# Altium schematic sheet 3DMouseMainBoardAssembly.SchDoc
size Letter
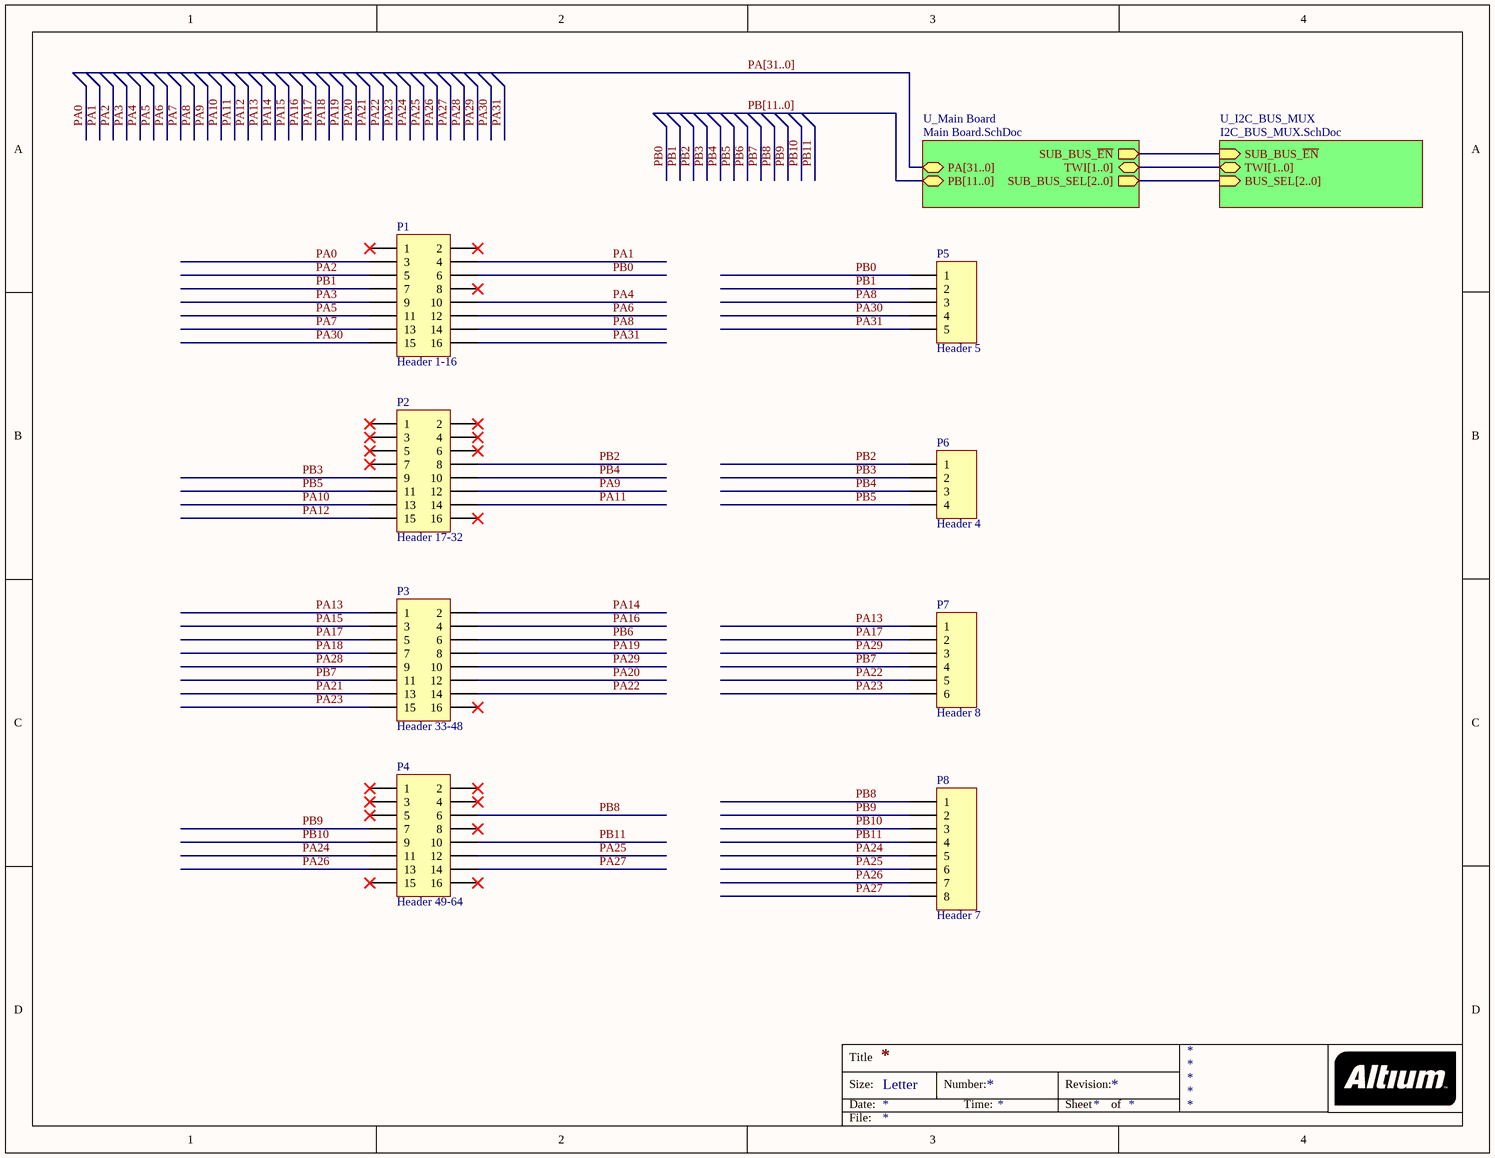
[diagram p0: 3DMouseMainBoardAssembly.SchDoc]

## Parts
P1  Header 1-16  [HDR2X8]
P2  Header 17-32  [HDR2X8]
P3  Header 33-48  [HDR2X8]
P4  Header 49-64  [HDR2X8]
P5  Header 5  [HDR1X5]
P6  Header 4  [HDR1X4]
P7  Header 8  [HDR1X6]
P8  Header 7  [HDR1X8]

## Sub-sheets
U_I2C_BUS_MUX = I2C_BUS_MUX.SchDoc: SUB_BUS_~{EN} (in), TWI[1..0] (bidir), BUS_SEL[2..0] (in)
U_Main Board = Main Board.SchDoc: TWI[1..0] (bidir), SUB_BUS_~{EN} (out), SUB_BUS_SEL[2..0] (out), PA[31..0] (bidir), PB[11..0] (bidir)

## Nets
PA0: P1.3
PA1: P1.4
PA2: P1.5
PA3: P1.9
PA4: P1.10
PA5: P1.11
PA6: P1.12
PA7: P1.13
PA8: P1.14 P5.3
PA9: P2.12
PA10: P2.13
PA11: P2.14
PA12: P2.15
PA13: P3.1 P7.1
PA14: P3.2
PA15: P3.3
PA16: P3.4
PA17: P3.5 P7.2
PA18: P3.7
PA19: P3.8
PA20: P3.12
PA21: P3.13
PA22: P3.14 P7.5
PA23: P3.15 P7.6
PA24: P4.11 P8.5
PA25: P4.12 P8.6
PA26: P4.13 P8.7
PA27: P4.14 P8.8
PA28: P3.9
PA29: P3.10 P7.3
PA30: P1.15 P5.4
PA31: P1.16 P5.5
PB0: P1.6 P5.1
PB1: P1.7 P5.2
PB2: P2.8 P6.1
PB3: P2.9 P6.2
PB4: P2.10 P6.3
PB5: P2.11 P6.4
PB6: P3.6
PB7: P3.11 P7.4
PB8: P4.6 P8.1
PB9: P4.7 P8.2
PB10: P4.9 P8.3
PB11: P4.10 P8.4
(unnamed): sheet U_I2C_BUS_MUX/SUB_BUS_~{EN}, sheet U_Main Board/SUB_BUS_~{EN}

Not connected (* = marked no-connect by the designer): P1 1* 2* 8*; P2 1* 2* 3* 4* 5* 6* 7* 16*; P3 16*; P4 1* 2* 3* 4* 5* 8* 15* 16*

## Buses and harness runs
bus PA[31..0] = sheet U_Main Board/PA[31..0]
bus PB[11..0] = sheet U_Main Board/PB[11..0]
bus sheet U_I2C_BUS_MUX/BUS_SEL[2..0] = sheet U_Main Board/SUB_BUS_SEL[2..0]
bus sheet U_I2C_BUS_MUX/TWI[1..0] = sheet U_Main Board/TWI[1..0]

## Notes on the sheet
- Title
- Size:
- Date:
- Letter
- Number:
- Time:
- Revision:
- Sheet
- of
- File:

## Library data of the parts
P1-P4 = Header 8X2: Header, 8-Pin, Dual row; LatestRevisionDate: 17-Jul-2002; LatestRevisionNote: Re-released for DXP Platform.; Publisher: Altium Limited
P5 = Header 5: Header, 5-Pin; LatestRevisionDate: 17-Jul-2002; LatestRevisionNote: Re-released for DXP Platform.; Publisher: Altium Limited
P6 = Header 4: Header, 4-Pin; LatestRevisionDate: 17-Jul-2002; LatestRevisionNote: Re-released for DXP Platform.; Publisher: Altium Limited
P7 = Header 6: Header, 6-Pin; LatestRevisionDate: 17-Jul-2002; LatestRevisionNote: Re-released for DXP Platform.; Publisher: Altium Limited
P8 = Header 8: Header, 8-Pin; LatestRevisionDate: 17-Jul-2002; LatestRevisionNote: Re-released for DXP Platform.; Publisher: Altium Limited